# Altium schematic sheet EEPROM_block.SchDoc
size A; SheetNumber: 7; SheetTotal: 8
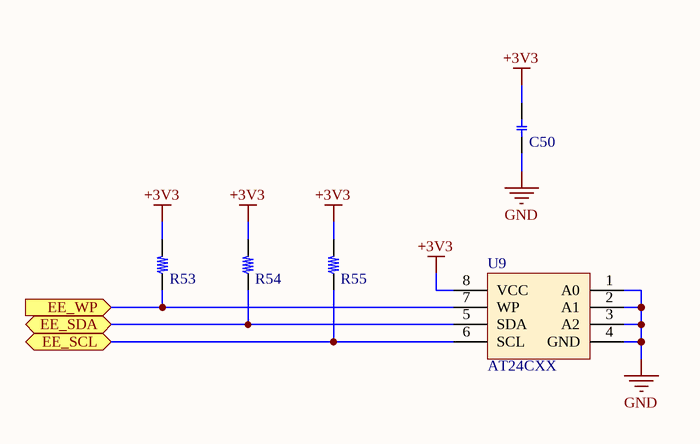
[diagram p0: EEPROM_block.SchDoc]

## Parts
C50  CAP_SMD  [C 0603]  (value not drawn)
R53  RES_SMD  [R 0603]  (value not drawn)
R54  RES_SMD  [R 0603]  (value not drawn)
R55  RES_SMD  [R 0603]  (value not drawn)
U9  AT24CXX  [SOIC-8]

## Ports
EE_SCL (bidir), EE_SDA (bidir), EE_WP (in)

## Nets
+3V3: C50.2 R53.2 R54.2 R55.2 U9.8(VCC)
GND: C50.1 U9.1(A0) U9.2(A1) U9.3(A2) U9.4(GND)
EE_SCL: R55.1 U9.6(SCL) ; port EE_SCL
EE_SDA: R54.1 U9.5(SDA) ; port EE_SDA
EE_WP: R53.1 U9.7(WP) ; port EE_WP